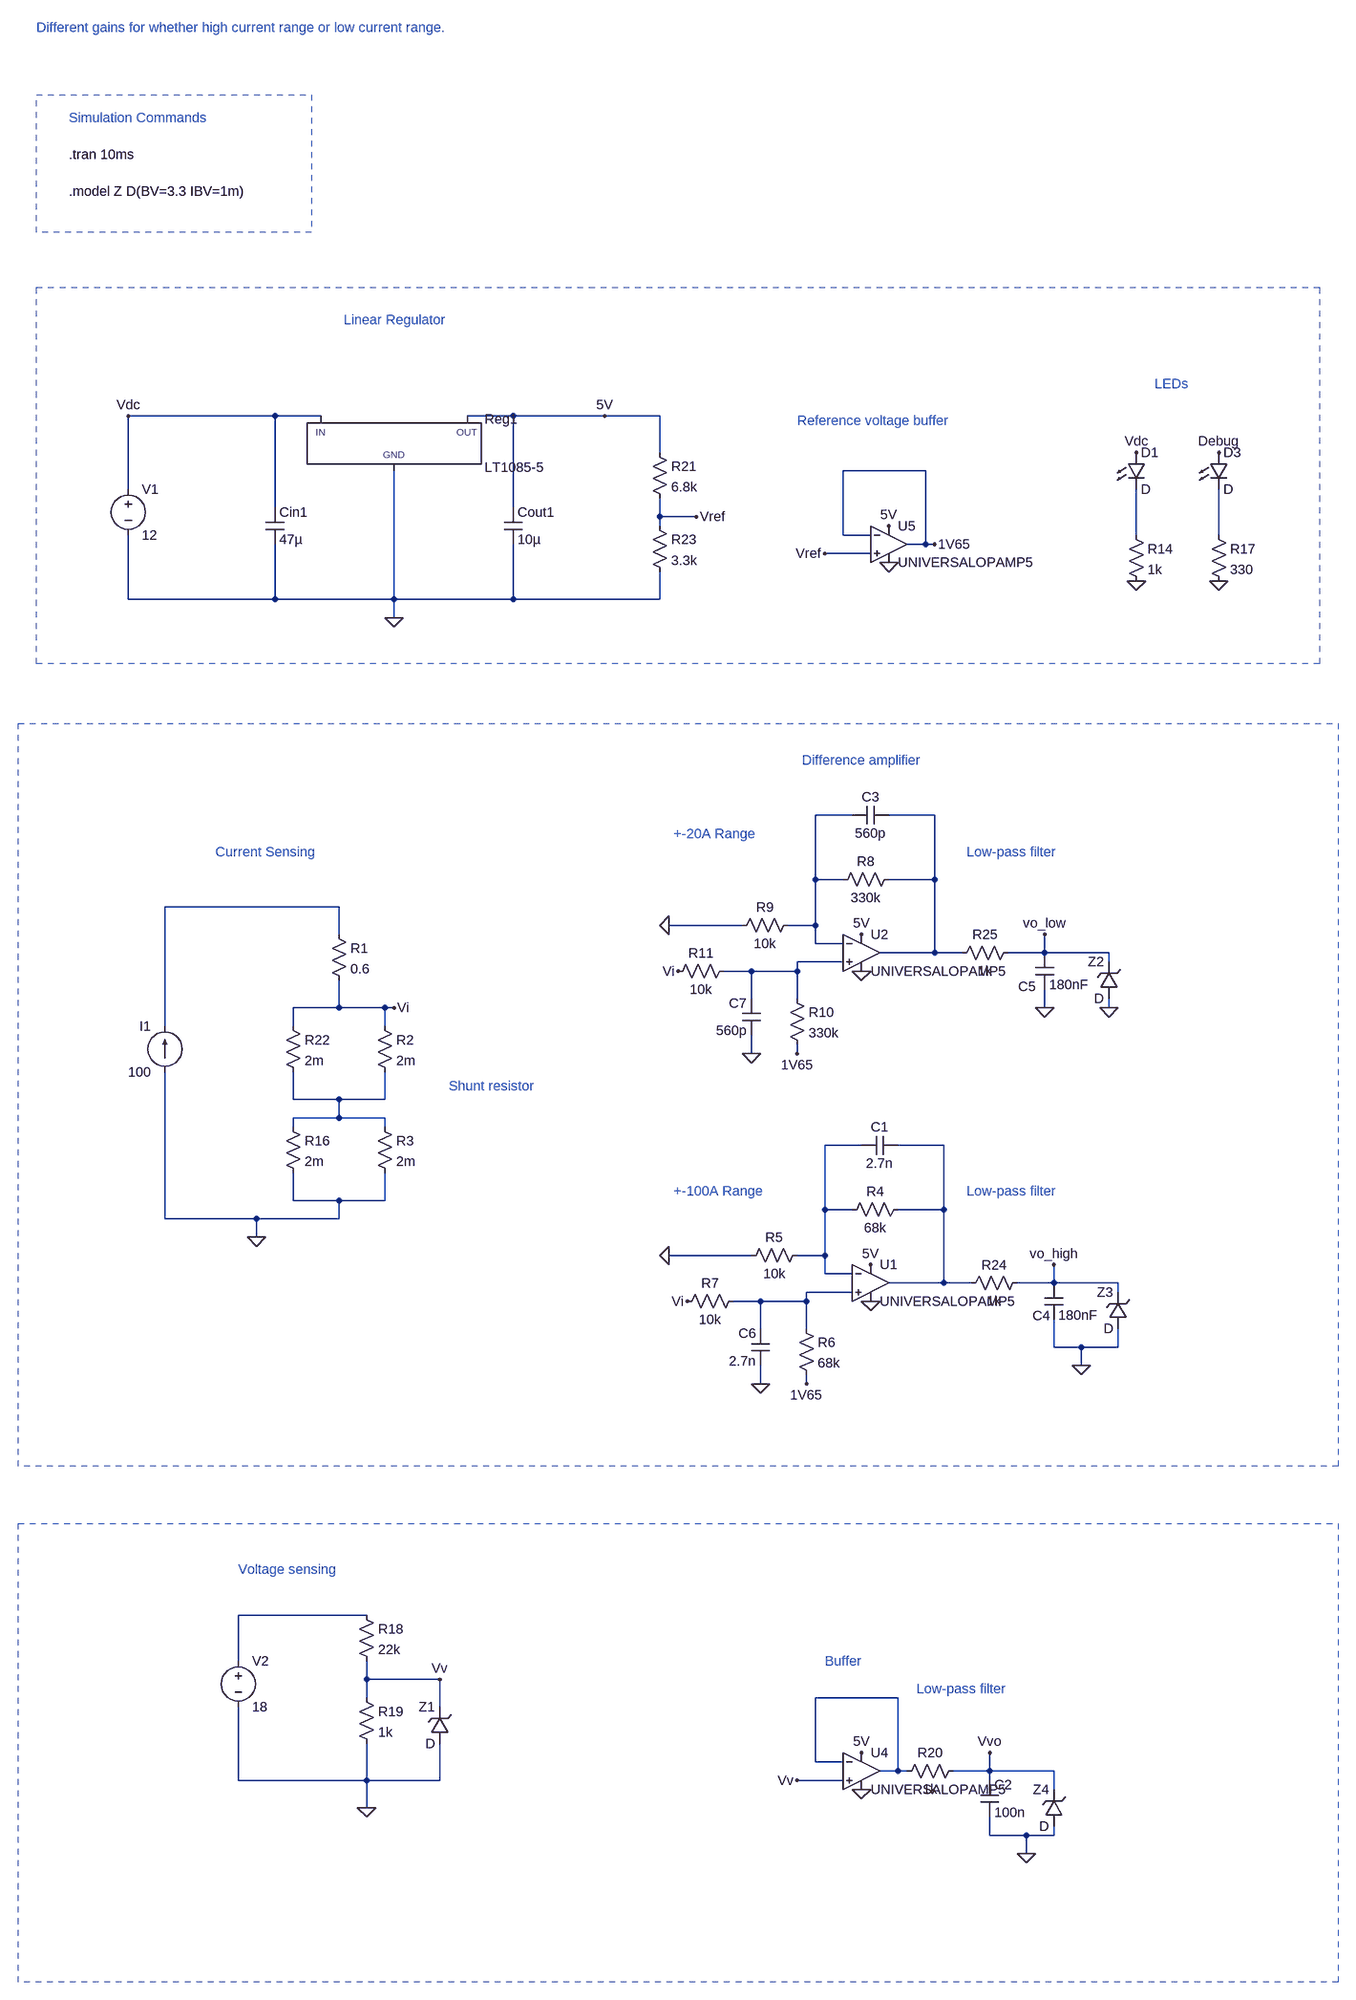
[diagram p0: schematic Multiple Gains.asc]
Multiple Gains.asc, the LTspice schematic file:
Version 4
SHEET 1 3460 1972
WIRE -416 -1024 -672 -1024
WIRE -336 -1024 -416 -1024
WIRE 0 -1024 -80 -1024
WIRE 160 -1024 0 -1024
WIRE 256 -1024 160 -1024
WIRE 256 -960 256 -1024
WIRE 720 -928 576 -928
WIRE -672 -896 -672 -1024
WIRE -416 -864 -416 -1024
WIRE 0 -864 0 -1024
WIRE 256 -848 256 -880
WIRE 320 -848 256 -848
WIRE 256 -832 256 -848
WIRE 576 -816 576 -928
WIRE 624 -816 576 -816
WIRE 1088 -816 1088 -896
WIRE 1232 -816 1232 -896
WIRE 720 -800 720 -928
WIRE 720 -800 688 -800
WIRE 736 -800 720 -800
WIRE 624 -784 544 -784
WIRE -672 -704 -672 -816
WIRE -416 -704 -416 -800
WIRE -416 -704 -672 -704
WIRE -208 -704 -208 -928
WIRE -208 -704 -416 -704
WIRE 0 -704 0 -800
WIRE 0 -704 -208 -704
WIRE 256 -704 256 -752
WIRE 256 -704 0 -704
WIRE -208 -672 -208 -704
WIRE 592 -304 528 -304
WIRE 736 -304 656 -304
WIRE 528 -192 528 -304
WIRE 576 -192 528 -192
WIRE 736 -192 736 -304
WIRE 736 -192 656 -192
WIRE -304 -144 -608 -144
WIRE 400 -112 272 -112
WIRE 528 -112 528 -192
WIRE 528 -112 480 -112
WIRE -304 -96 -304 -144
WIRE 528 -80 528 -112
WIRE 576 -80 528 -80
WIRE 736 -64 736 -192
WIRE 736 -64 640 -64
WIRE 784 -64 736 -64
WIRE 928 -64 928 -96
WIRE 928 -64 864 -64
WIRE 1040 -64 928 -64
WIRE 576 -48 496 -48
WIRE 1040 -48 1040 -64
WIRE 416 -32 368 -32
WIRE 496 -32 496 -48
WIRE 496 -32 416 -32
WIRE 416 16 416 -32
WIRE 496 16 496 -32
WIRE -304 32 -304 -16
WIRE -304 32 -384 32
WIRE -224 32 -304 32
WIRE -208 32 -224 32
WIRE 928 32 928 0
WIRE 1040 32 1040 16
WIRE -608 64 -608 -144
WIRE -384 64 -384 32
WIRE -224 64 -224 32
WIRE 416 112 416 80
WIRE 496 112 496 96
WIRE -384 192 -384 144
WIRE -304 192 -384 192
WIRE -224 192 -224 144
WIRE -224 192 -304 192
WIRE -304 224 -304 192
WIRE -304 224 -384 224
WIRE -224 224 -304 224
WIRE -384 240 -384 224
WIRE -224 240 -224 224
WIRE 608 272 544 272
WIRE 752 272 672 272
WIRE -384 368 -384 320
WIRE -304 368 -384 368
WIRE -224 368 -224 320
WIRE -224 368 -304 368
WIRE 544 384 544 272
WIRE 592 384 544 384
WIRE 752 384 752 272
WIRE 752 384 672 384
WIRE -608 400 -608 144
WIRE -448 400 -608 400
WIRE -304 400 -304 368
WIRE -304 400 -448 400
WIRE -448 432 -448 400
WIRE 416 464 272 464
WIRE 544 464 544 384
WIRE 544 464 496 464
WIRE 544 496 544 464
WIRE 592 496 544 496
WIRE 752 512 752 384
WIRE 752 512 656 512
WIRE 800 512 752 512
WIRE 944 512 944 480
WIRE 944 512 880 512
WIRE 1056 512 944 512
WIRE 592 528 512 528
WIRE 1056 528 1056 512
WIRE 432 544 384 544
WIRE 512 544 512 528
WIRE 512 544 432 544
WIRE 432 592 432 544
WIRE 512 592 512 544
WIRE 944 624 944 576
WIRE 992 624 944 624
WIRE 1056 624 1056 592
WIRE 1056 624 992 624
WIRE 992 656 992 624
WIRE 432 688 432 656
WIRE 512 688 512 672
WIRE -256 1120 -480 1120
WIRE -480 1200 -480 1120
WIRE -256 1232 -256 1200
WIRE -128 1232 -256 1232
WIRE -256 1264 -256 1232
WIRE 672 1264 528 1264
WIRE -128 1280 -128 1232
WIRE 528 1376 528 1264
WIRE 576 1376 528 1376
WIRE 672 1392 672 1264
WIRE 672 1392 640 1392
WIRE 688 1392 672 1392
WIRE 832 1392 832 1360
WIRE 832 1392 768 1392
WIRE 944 1392 832 1392
WIRE -480 1408 -480 1280
WIRE -256 1408 -256 1344
WIRE -256 1408 -480 1408
WIRE -128 1408 -128 1344
WIRE -128 1408 -256 1408
WIRE 576 1408 496 1408
WIRE 832 1408 832 1392
WIRE 944 1424 944 1392
WIRE -256 1456 -256 1408
WIRE 832 1504 832 1472
WIRE 896 1504 832 1504
WIRE 944 1504 944 1488
WIRE 944 1504 896 1504
WIRE 896 1536 896 1504
FLAG 272 464 0
FLAG 624 544 0
FLAG 624 480 5V
FLAG 944 480 vo_high
FLAG 272 -112 0
FLAG 608 -32 0
FLAG 608 -96 5V
FLAG 928 -96 vo_low
FLAG 160 -1024 5V
FLAG -208 -672 0
FLAG -208 32 Vi
FLAG 288 -32 Vi
FLAG 304 544 Vi
FLAG -128 1232 Vv
FLAG 496 1408 Vv
FLAG 608 1424 0
FLAG 608 1360 5V
FLAG 896 1536 0
FLAG 832 1360 Vvo
FLAG -256 1456 0
FLAG 1088 -736 0
FLAG 1088 -960 Vdc
FLAG 1232 -736 0
FLAG 1232 -960 Debug
FLAG 544 -784 Vref
FLAG 656 -768 0
FLAG 656 -832 5V
FLAG 320 -848 Vref
FLAG -448 432 0
FLAG 992 656 0
FLAG 928 32 0
FLAG 416 112 0
FLAG 432 688 0
FLAG 736 -800 1V65
FLAG 496 112 1V65
FLAG 512 688 1V65
FLAG -672 -1024 Vdc
FLAG 1040 32 0
SYMBOL res -320 -112 R0
SYMATTR InstName R1
SYMATTR Value 0.6
SYMBOL res -240 48 R0
SYMATTR InstName R2
SYMATTR Value 2m
SYMBOL res 688 368 R90
WINDOW 0 0 56 VBottom 2
WINDOW 3 32 56 VTop 2
SYMATTR InstName R4
SYMATTR Value 68k
SYMBOL res 512 448 R90
WINDOW 0 0 56 VBottom 2
WINDOW 3 32 56 VTop 2
SYMATTR InstName R5
SYMATTR Value 10k
SYMBOL res 496 576 R0
SYMATTR InstName R6
SYMATTR Value 68k
SYMBOL res 400 528 R90
WINDOW 0 0 56 VBottom 2
WINDOW 3 32 56 VTop 2
SYMATTR InstName R7
SYMATTR Value 10k
SYMBOL OpAmps\\UniversalOpAmp5 624 512 R0
SYMATTR InstName U1
SYMBOL res 672 -208 R90
WINDOW 0 0 56 VBottom 2
WINDOW 3 32 56 VTop 2
SYMATTR InstName R8
SYMATTR Value 330k
SYMBOL res 496 -128 R90
WINDOW 0 0 56 VBottom 2
WINDOW 3 32 56 VTop 2
SYMATTR InstName R9
SYMATTR Value 10k
SYMBOL res 480 0 R0
SYMATTR InstName R10
SYMATTR Value 330k
SYMBOL res 384 -48 R90
WINDOW 0 0 56 VBottom 2
WINDOW 3 32 56 VTop 2
SYMATTR InstName R11
SYMATTR Value 10k
SYMBOL OpAmps\\UniversalOpAmp5 608 -64 R0
SYMATTR InstName U2
SYMBOL res -400 48 R0
SYMATTR InstName R22
SYMATTR Value 2m
SYMBOL current -608 144 R180
WINDOW 0 24 80 Left 2
WINDOW 3 24 0 Left 2
WINDOW 123 0 0 Left 0
WINDOW 39 0 0 Left 0
SYMATTR InstName I1
SYMATTR Value 100
SYMBOL res -240 224 R0
SYMATTR InstName R3
SYMATTR Value 2m
SYMBOL res -400 224 R0
SYMATTR InstName R16
SYMATTR Value 2m
SYMBOL PowerProducts/LT1085-5 -208 -1024 R0
SYMATTR InstName Reg1
SYMBOL cap -432 -864 R0
SYMATTR InstName Cin1
SYMATTR Value 47µ
SYMATTR SpiceLine Rser=0.001
SYMBOL cap -16 -864 R0
SYMATTR InstName Cout1
SYMATTR Value 10µ
SYMATTR SpiceLine Rser=0.001
SYMBOL voltage -480 1184 R0
WINDOW 123 0 0 Left 0
WINDOW 39 0 0 Left 0
SYMATTR InstName V2
SYMATTR Value 18
SYMBOL res -272 1104 R0
SYMATTR InstName R18
SYMATTR Value 22k
SYMBOL res -272 1248 R0
SYMATTR InstName R19
SYMATTR Value 1k
SYMBOL OpAmps\\UniversalOpAmp5 608 1392 R0
SYMATTR InstName U4
SYMBOL res 784 1376 R90
WINDOW 0 0 56 VBottom 2
WINDOW 3 32 56 VTop 2
SYMATTR InstName R20
SYMATTR Value 1k
SYMBOL cap 816 1408 R0
SYMATTR InstName C2
SYMATTR Value 100n
SYMBOL zener -112 1344 R180
WINDOW 0 24 64 Left 2
WINDOW 3 24 0 Left 2
SYMATTR InstName Z1
SYMBOL voltage -672 -912 R0
WINDOW 123 0 0 Left 0
WINDOW 39 0 0 Left 0
SYMATTR InstName V1
SYMATTR Value 12
SYMBOL LED 1072 -960 R0
SYMATTR InstName D1
SYMBOL res 1072 -832 R0
SYMATTR InstName R14
SYMATTR Value 1k
SYMBOL LED 1216 -960 R0
SYMATTR InstName D3
SYMBOL res 1216 -832 R0
SYMATTR InstName R17
SYMATTR Value 330
SYMBOL res 240 -976 R0
SYMATTR InstName R21
SYMATTR Value 6.8k
SYMBOL res 240 -848 R0
SYMATTR InstName R23
SYMATTR Value 3.3k
SYMBOL OpAmps\\UniversalOpAmp5 656 -800 R0
SYMATTR InstName U5
SYMBOL res 896 496 R90
WINDOW 0 0 56 VBottom 2
WINDOW 3 32 56 VTop 2
SYMATTR InstName R24
SYMATTR Value 1k
SYMBOL cap 928 512 R0
WINDOW 0 -21 57 Left 2
SYMATTR InstName C4
SYMATTR Value 180nF
SYMBOL res 880 -80 R90
WINDOW 0 0 56 VBottom 2
WINDOW 3 32 56 VTop 2
SYMATTR InstName R25
SYMATTR Value 1k
SYMBOL cap 912 -64 R0
WINDOW 0 -30 59 Left 2
SYMATTR InstName C5
SYMATTR Value 180nF
SYMBOL cap 672 256 R90
WINDOW 0 0 32 VBottom 2
WINDOW 3 32 32 VTop 2
SYMATTR InstName C1
SYMATTR Value 2.7n
SYMBOL cap 656 -320 R90
WINDOW 0 0 32 VBottom 2
WINDOW 3 32 32 VTop 2
SYMATTR InstName C3
SYMATTR Value 560p
SYMBOL cap 448 656 R180
WINDOW 0 24 56 Left 2
WINDOW 3 24 8 Left 2
SYMATTR InstName C6
SYMATTR Value 2.7n
SYMBOL cap 432 80 R180
WINDOW 0 24 56 Left 2
WINDOW 3 24 8 Left 2
SYMATTR InstName C7
SYMATTR Value 560p
SYMBOL zener 1056 16 R180
WINDOW 0 24 64 Left 2
WINDOW 3 24 0 Left 2
SYMATTR InstName Z2
SYMBOL zener 1072 592 R180
WINDOW 0 24 64 Left 2
WINDOW 3 24 0 Left 2
SYMATTR InstName Z3
SYMBOL zener 960 1488 R180
WINDOW 0 24 64 Left 2
WINDOW 3 24 0 Left 2
SYMATTR InstName Z4
TEXT -776 -1480 Left 2 !.tran 10ms
TEXT -832 -1712 Left 2 ;Different gains for whether high current range or low current range.
TEXT -480 1040 Left 2 ;Voltage sensing
TEXT -776 -1416 Left 2 !.model Z D(BV=3.3 IBV=1m)
TEXT -520 -240 Left 2 ;Current Sensing
TEXT 280 -272 Left 2 ;+-20A Range
TEXT 280 352 Left 2 ;+-100A Range
TEXT 1120 -1080 Left 2 ;LEDs
TEXT -296 -1192 Left 2 ;Linear Regulator
TEXT 496 -1016 Left 2 ;Reference voltage buffer
TEXT -112 168 Left 2 ;Shunt resistor
TEXT 504 -400 Left 2 ;Difference amplifier
TEXT 544 1200 Left 2 ;Buffer
TEXT 704 1248 Left 2 ;Low-pass filter
TEXT 792 352 Left 2 ;Low-pass filter
TEXT 792 -240 Left 2 ;Low-pass filter
TEXT -776 -1544 Left 2 ;Simulation Commands
RECTANGLE Normal 1408 -592 -832 -1248 2
RECTANGLE Normal 1440 832 -864 -464 2
RECTANGLE Normal 1440 1760 -864 960 2
RECTANGLE Normal -352 -1344 -832 -1584 2

The netlist it stands for:
* Multiple Gains.asc
R1 N005 Vi 0.6
R2 Vi N007 2m
R4 N009 N008 68k
R5 N008 0 10k
R6 N010 1V65 68k
R7 N010 Vi 10k
XU1 N010 N008 5V 0 N009 level5 Avol=1Meg GBW=10Meg Phimargin=45 SlewPos=10Meg SlewNeg=10Meg En=0 Enk=0 In=0 Ink=0 Rcm=500Meg Ccm=1p Rdiff=500k Cdiff=2p Ro=1k Vos=0 Ibp=2n Ibn=1n Iq=1m Rail=0 Ilimit=25m  ; UNIVERSALOPAMP5, pins In+ In- V+ V- OUT
R8 N004 N003 330k
R9 N003 0 10k
R10 N006 1V65 330k
R11 N006 Vi 10k
XU2 N006 N003 5V 0 N004 level5 Avol=1Meg GBW=10Meg Phimargin=45 SlewPos=10Meg SlewNeg=10Meg En=0 Enk=0 In=0 Ink=0 Rcm=500Meg Ccm=1p Rdiff=500k Cdiff=2p Ro=1k Vos=0 Ibp=2n Ibn=1n Iq=1m Rail=0 Ilimit=25m  ; UNIVERSALOPAMP5, pins In+ In- V+ V- OUT
R22 Vi N007 2m
I1 0 N005 100
R3 N007 0 2m
R16 N007 0 2m
XReg1 0 5V Vdc LT1085-5  ; pins GND OUT IN
Cin1 Vdc 0 47µ Rser=0.001
Cout1 5V 0 10µ Rser=0.001
V2 N011 0 18
R18 N011 Vv 22k
R19 Vv 0 1k
XU4 Vv N012 5V 0 N012 level5 Avol=1Meg GBW=10Meg Phimargin=45 SlewPos=10Meg SlewNeg=10Meg En=0 Enk=0 In=0 Ink=0 Rcm=500Meg Ccm=1p Rdiff=500k Cdiff=2p Ro=1k Vos=0 Ibp=2n Ibn=1n Iq=1m Rail=0 Ilimit=25m  ; UNIVERSALOPAMP5, pins In+ In- V+ V- OUT
R20 Vvo N012 1k
C2 Vvo 0 100n
D§Z1 0 Vv D
V1 Vdc 0 12
D1 Vdc N001 D
R14 N001 0 1k
D3 Debug N002 D
R17 N002 0 330
R21 5V Vref 6.8k
R23 Vref 0 3.3k
XU5 Vref 1V65 5V 0 1V65 level5 Avol=1Meg GBW=10Meg Phimargin=45 SlewPos=10Meg SlewNeg=10Meg En=0 Enk=0 In=0 Ink=0 Rcm=500Meg Ccm=1p Rdiff=500k Cdiff=2p Ro=1k Vos=0 Ibp=2n Ibn=1n Iq=1m Rail=0 Ilimit=25m  ; UNIVERSALOPAMP5, pins In+ In- V+ V- OUT
R24 vo_high N009 1k
C4 vo_high 0 180nF
R25 vo_low N004 1k
C5 vo_low 0 180nF
C1 N009 N008 2.7n
C3 N004 N003 560p
C6 0 N010 2.7n
C7 0 N006 560p
D§Z2 0 vo_low D
D§Z3 0 vo_high D
D§Z4 0 Vvo D
.model D D
.lib standard.dio
.tran 10ms
* Different gains for whether high current range or low current range.
* Voltage sensing
.model Z D(BV=3.3 IBV=1m)
* Current Sensing
* +-20A Range
* +-100A Range
* LEDs
* Linear Regulator
* Reference voltage buffer
* Shunt resistor
* Difference amplifier
* Buffer
* Low-pass filter
* Low-pass filter
* Low-pass filter
* Simulation Commands
.backanno
.end